# EAGLE design ptt_interface (EAGLE 7.7.0)
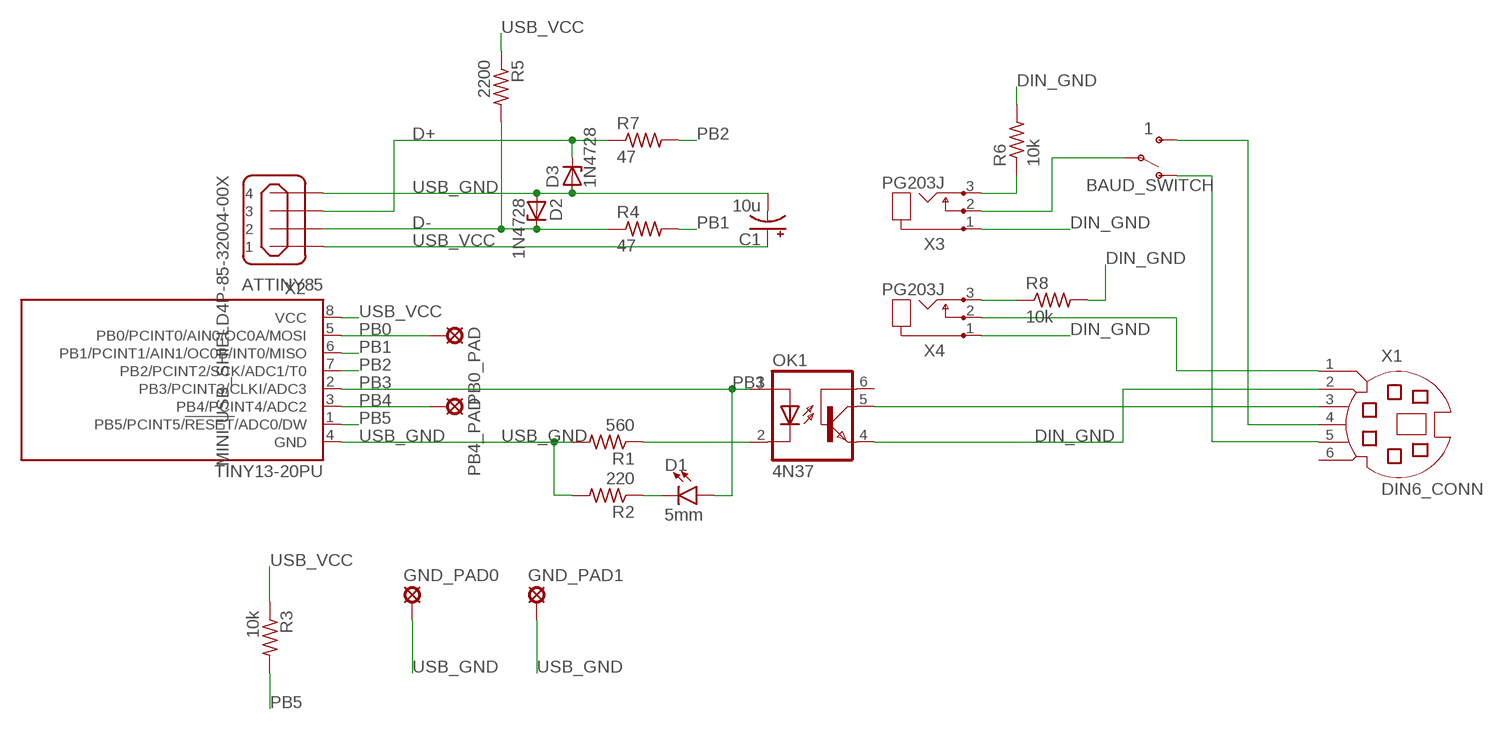
[diagram p0: schematic, sheet 1]

## Parts
ATTINY85  TINY13-20PU  [DIL08]
BAUD_SWITCH  1  SWITCH-SPDT  [SWITCH_SPDT_PTH_15X5.6MM]
C1  10u  CPOL-USE2.5-5  [E2,5-5]
D1  5mm  LED5MM  [LED_5MM]
D2  1N4728  [DO41Z10]
D3  1N4728  [DO41Z10]
GND_PAD0  LSP11  [LSP11]
GND_PAD1  LSP11  [LSP11]
OK1  4N37  [DIL06]
PB0_PAD  LSP11  [LSP11]
PB4_PAD  LSP11  [LSP11]
R1  560  R-US_0207/10  [0207/10]
R2  220  R-US_0207/10  [0207/10]
R3  10k  R-US_0207/10  [0207/10]
R4  47  R-US_0207/10  [0207/10]
R5  2200  R-US_0207/10  [0207/10]
R6  10k  R-US_0207/10  [0207/10]
R7  47  R-US_0207/10  [0207/10]
R8  10k  R-US_0207/10  [0207/10]
X1  DIN6_CONN  MD06SS  [MDIN06SS]
X2  MINI-USB_SHIELD4P-85-32004-00X  [85-32004-00X]
X3  PG203J  [PG203J]
X4  PG203J  [PG203J]

## Nets
D+: D3.C R7.1 X2.3
D-: D2.C R4.1 R5.2 X2.2
DIN_GND: OK1.4(EMI) R6.2 R8.2 X1.2 X3.1 X4.1
N$1: OK1.2(C) R1.1
N$2: D1.K(C) R2.1
N$3: OK1.5(COL) X1.3
N$4: BAUD_SWITCH.2(P) X3.2
N$5: R6.1 X3.3
N$6: R8.1 X4.3
N$7: BAUD_SWITCH.3(S) X1.4
N$8: BAUD_SWITCH.1(O) X1.5
N$10: X1.1 X4.2
PB0: ATTINY85.5(PB0/PCINT0/AIN0/OC0A/MOSI) PB0_PAD.MP
PB1: ATTINY85.6(PB1/PCINT1/AIN1/OC0B/INT0/MISO) R4.2
PB2: ATTINY85.7(PB2/PCINT2/SCK/ADC1/T0) R7.2
PB3: ATTINY85.2(PB3/PCINT3/CLKI/ADC3) D1.A OK1.1(A)
PB4: ATTINY85.3(PB4/PCINT4/ADC2) PB4_PAD.MP
PB5: ATTINY85.1(PB5/PCINT5/!RESET!/ADC0/DW) R3.2
USB_GND: ATTINY85.4(GND) C1.- D2.A D3.A GND_PAD0.MP GND_PAD1.MP R1.2 R2.2 X2.4
USB_VCC: ATTINY85.8(VCC) C1.+ R3.1 R5.1 X2.1
Unconnected: OK1.6(BAS) X1.6 X2.M1(S1) X2.M2(S2)

## Library data of the parts
ATTINY85 = atmel:TINY13: 8-bit AVR Microcontroller with 1K Bytes In-System Programmable Flash Source: http://www.atmel.com/dyn/resources/prod_documents/2535S.pdf; MPN: ATTINY13-20PU; OC_FARNELL: 9171550; OC_NEWARK: 96K6521
BAUD_SWITCH = dylon_mutz:SWITCH-SPDT: Single Pole, Double Throw (SPDT) Switch Single-pole, double-throw (SPDT) switch. Variant Overview SMD-AYZ0202 Surface Mount DPDT Switch <https://www.sparkfun.com/products/597> (COM-00597) Used on e.g. LilyPad Arduino USB - ATmega32U4 Board <https://www.sparkfun.com/products/12049> PTH-11.6X4.0MM SPDT Mini Power Switch <https://www.sparkfun.com/products/102> (COM-00102) Used on e.g. SparkFun Simon Says - Through-Hole Soldering Kit <https://www.sparkfun.com/products/10547> (KIT-10547) PTH-11.6X4.0MM-KIT KIT version of SPDT Mini Power Switch - Simplifies soldering by removing tStop of switch pins - only one side can be soldered. PTH-11.6X4.0MM-LOCK LOCK version of SPDT Mini Power Switch - Offset pins hold switch in place for easier soldering. SMD-RIGHT-ANGLE Surface Mount Right Angle Switch <https://www.sparkfun.com/products/10860> (COM-10860) Used on e.g. SparkFun ESP8266 Thing <https://www.sparkfun.com/products/13231>
C1 = rcl:CPOL-US: POLARIZED CAPACITOR, American symbol
D1 = SparkFun-LED:LED: LED (Generic) Standard schematic elements and footprints for 5mm, 3mm, 1206, and 0603 sized LEDs. Generic LEDs with no color specified.
D2 D3 = diode:1N4728: Z DIODE 3.3 V, 1W, 5 percent
GND_PAD0 GND_PAD1 PB0_PAD PB4_PAD = solpad:LSP11: SOLDER PAD drill 1.1 mm
OK1 = optocoupler:4N37: OPTO COUPLER Source: http://www.fairchildsemi.com/pf/4N/4N35-M.html; MF: FAIRCHILD SEMICONDUCTOR; MPN: 4N37; OC_FARNELL: 1612456; OC_NEWARK: 72K9948
R1-R8 = resistor:R-US_: RESISTOR, American symbol
X1 = dylon_mutz:MD06SS: YAMAICHI CONNECTOR; OC_FARNELL: unknown; OC_NEWARK: unknown
X2 = con-cypressindustries:MINI-USB_SHIELD4P-: MINI USB 4 Pol. Source: www.cypressindustries.com; OC_FARNELL: unknown; OC_NEWARK: unknown
X3 X4 = dylon_mutz:PG203J: MIC/HEADPHONE JACK CUI 3.5mm mono microphone/headphone jack MJ-3565N (CUI); OC_FARNELL: unknown; OC_NEWARK: unknown

## Board
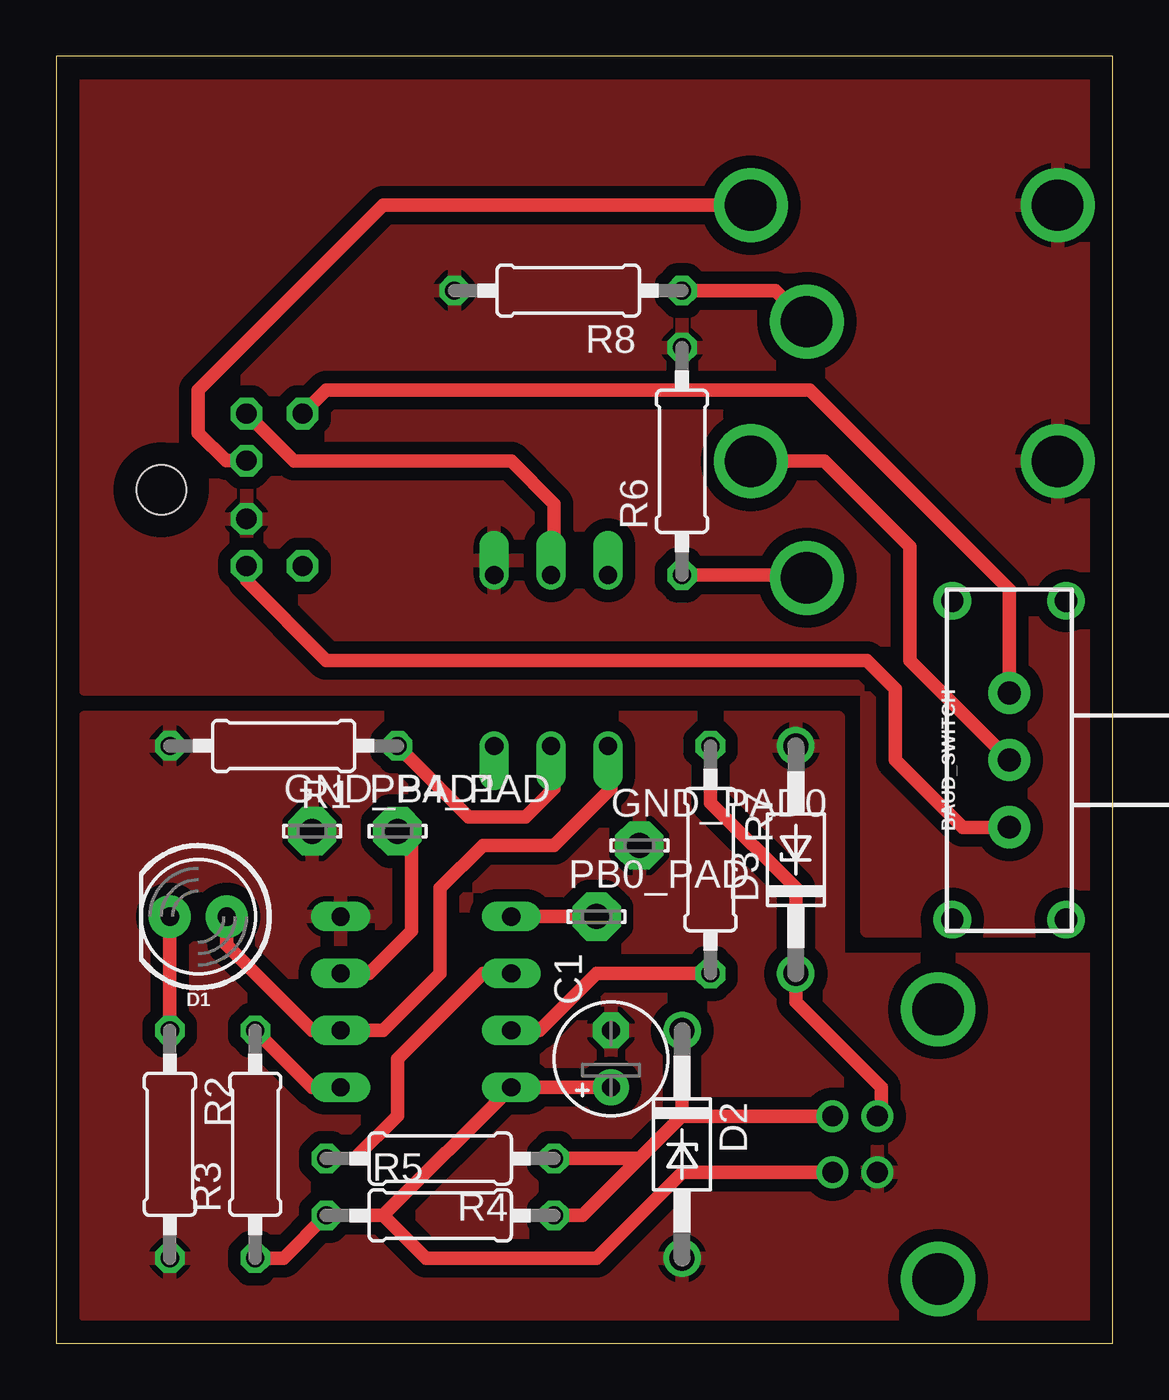
[diagram p1: board, top side]
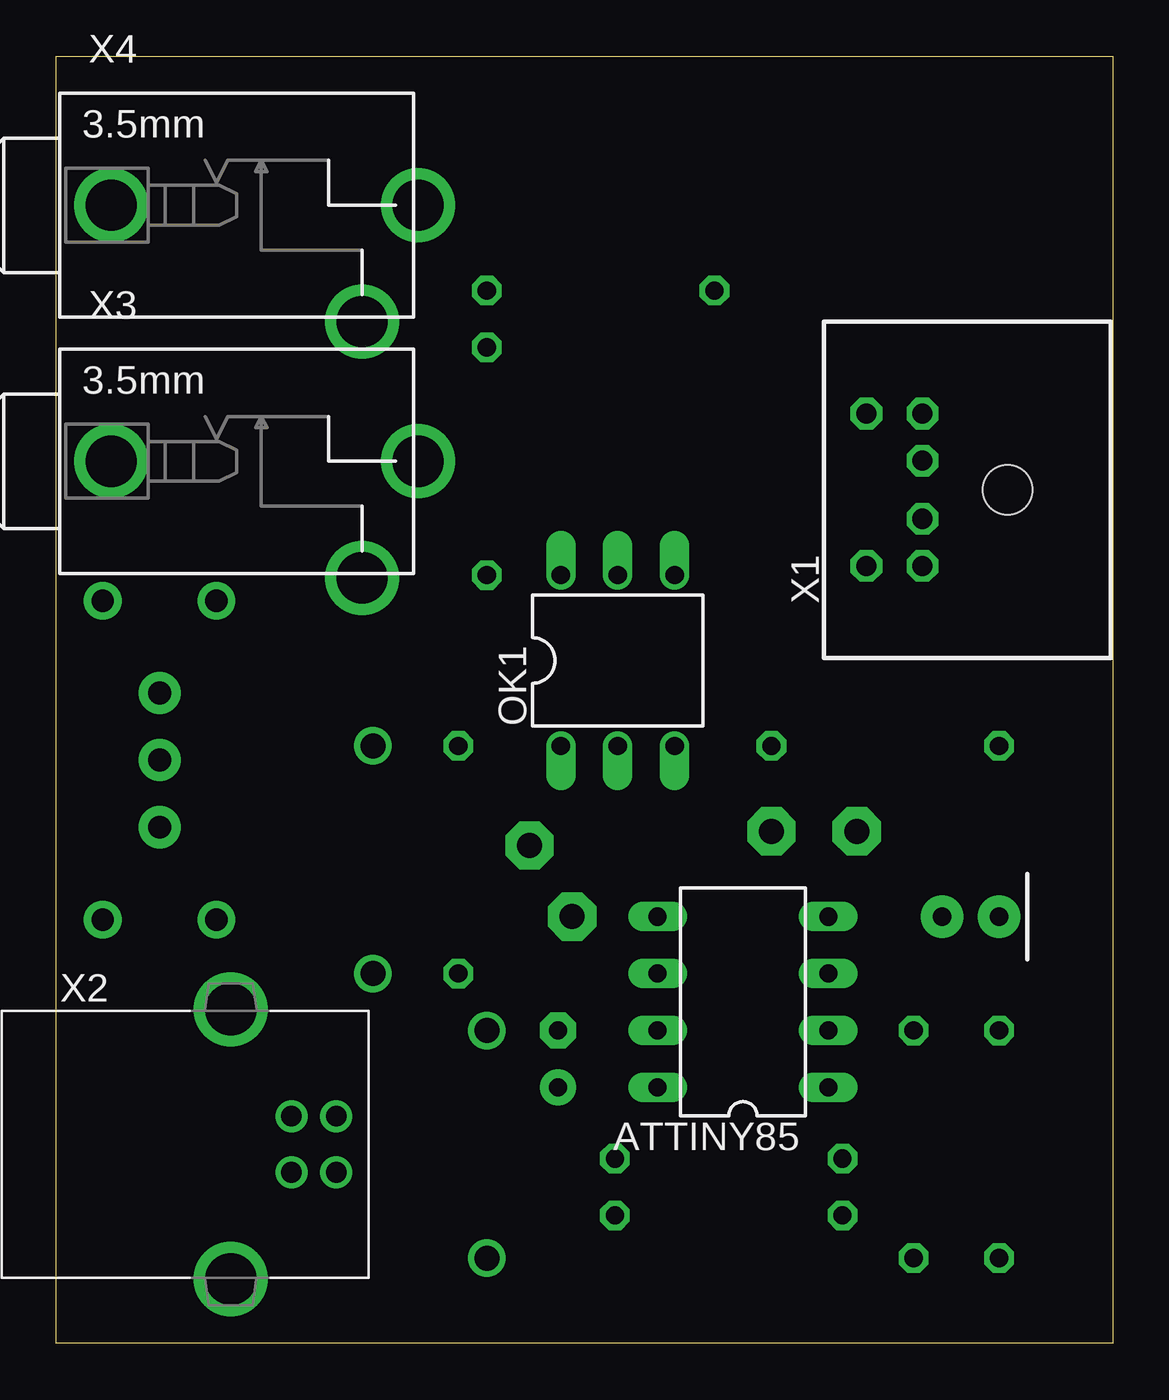
[diagram p2: board, bottom side, seen from below]

Size 47.17 x 57.46 mm. Coordinates in mm from the lower left corner, seen from the top.
Outline: 0,0 47.17,0 47.17,57.46 0,57.46 0,0
Copper layers (1*16): Top 0.035mm / dielectric 1.5mm / Bottom 0.035mm
Design rules "default *": minimum track width 10mil, minimum drill 24mil, track to track 22mil, track to pad 8mil, pad to pad 8mil, via to via 8mil, smd to smd 8mil, copper to edge 40mil, drill to drill 8mil, minimum pad ring 10mil, minimum via ring 8mil, stop-mask expansion 4mil, vias tented up to drill 0mil, thermal gap 10mil

### Footprints (pad centres in the part's own frame; a part is rotated, then mirrored left to right if it is on the bottom)
DIL08 = drill 0.813 long: 1 -3.81,-3.81; 2 -1.27,-3.81; 3 1.27,-3.81; 4 3.81,-3.81; 5 3.81,3.81; 6 1.27,3.81; 7 -1.27,3.81; 8 -3.81,3.81
SWITCH_SPDT_PTH_15X5.6MM = drill 1.016 pad 1.88: 1 0,2.997; 2 0,0; 3 0,-2.997 | drill 1 pad 1.676: P$1 -2.54,7.112; P$2 2.54,7.112; P$3 -2.54,-7.112; P$4 2.54,-7.112
E2,5-5 = drill 0.813 pad 1.6: + -1.27,0 | drill 0.813 pad 1.6 octagon: - 1.27,0
LED_5MM = drill 0.813 pad 1.88: A -1.27,0; K 1.27,0
DO41Z10 = drill 1.118: A 5.08,0; C -5.08,0
LSP11 = drill 1.118 pad 2.159 octagon: MP 0,0
DIL06 = drill 0.813 offset: 1 -2.54,-3.81; 2 0,-3.81; 3 2.54,-3.81; 4 2.54,3.81; 5 0,3.81; 6 -2.54,3.81
0207/10 = drill 0.813 octagon: 1 -5.08,0; 2 5.08,0
MDIN06SS = drill 0.9 octagon: 1 1.3,8.5; 2 -1.3,8.5; 3 3.4,8.5; 4 -3.4,8.5; 5 3.4,11; 6 -3.4,11 | hole 2.2: 0,4.7
85-32004-00X = drill 0.92 pad 1.27: 1 4.71,-1.25; 2 4.71,1.25; 3 2.71,1.25; 4 2.71,-1.25 | drill 2.3 pad 3: M1 0,6.02; M2 0,-6.02
PG203J = drill 2.286 pad 3.048: 1 -4.7,0; 2 9,0; 3 6.5,-5.2

### Placement (x,y rotation side)
ATTINY85  16.51,15.24 90 bottom
BAUD_SWITCH  42.55,26.04 0 top
C1  24.77,12.7 90 top
D1  6.35,19.05 180 top
D2  27.94,8.89 270 top
D3  33.02,21.59 90 top
GND_PAD0  26.04,22.23 0 top
GND_PAD1  11.43,22.86 0 top
OK1  22.1,30.48 0 bottom
PB0_PAD  24.13,19.05 0 top
PB4_PAD  15.24,22.86 0 top
R1  10.16,26.67 180 top
R2  5.08,8.89 270 top
R3  8.89,8.89 90 top
R4  17.14,8.26 180 top
R5  17.14,5.71 0 top
R6  27.94,39.37 90 top
R7  29.21,21.59 270 top
R8  22.86,46.99 180 top
X1  0,38.1 90 bottom
X2  39.37,8.89 0 bottom
X3  40.01,39.37 0 bottom
X4  40.01,50.8 0 bottom

### Tracks (layer width: path | path; a pad name or v marks a point on that pad's centre or on a via)
D+
  Top 0.61: R7.1 29.21,24.13 33.02,20.32 D3.C 33.02,15.24 36.83,11.43 36.83,10.31 X2.3
D-
  Top 0.61: R4.1 26.04,8.26 | 26.04,8.26 27.94,10.16 | 27.94,10.16 D2.C | X2.2 27.96,10.14 27.94,10.16 | R5.2 23.5,5.71 26.04,8.26
DIN_GND
  pour Top: 46.35,18.41 36.2,18.41 36.2,29.21 1.27,29.21 1.27,56.52 46.35,56.52
N$1
  Top 0.61: R1.1 18.41,23.5 20.95,23.5 22.23,24.77 22.23,26.54 OK1.2
N$2
  Top 0.61: R2.1 D1.K
N$3
  Top 0.61: X1.3 10.63,39.37 20.32,39.37 22.23,37.47 22.23,34.42 OK1.5
N$4
  Top 0.61: BAUD_SWITCH.2 38.1,30.48 38.1,35.56 34.29,39.37 X3.2
N$5
  Top 0.61: X3.3 33.38,34.29 R6.1
N$6
  Top 0.61: X4.3 32.12,46.99 R8.1
N$7
  Top 0.61: X1.4 8.5,34.05 12.06,30.48 36.2,30.48 37.47,29.21 37.47,26.04 40.46,23.04 BAUD_SWITCH.3
N$8
  Top 0.61: BAUD_SWITCH.1 42.55,33.66 33.66,42.55 12.04,42.55 X1.5
N$10
  Top 0.61: X1.1 7.59,39.4 6.35,40.64 6.35,42.55 14.61,50.8 X4.2
PB0
  Top 0.61: ATTINY85.5 PB0_PAD.MP
PB1
  Top 0.61: ATTINY85.6 19.05,16.51 15.24,12.7 15.24,10.16 13.34,8.26 R4.2
PB2
  Top 0.61: ATTINY85.7 21.59,13.97 24.13,16.51 R7.2
PB3
  Top 0.61: D1.A 7.62,17.78 11.43,13.97 ATTINY85.2 14.61,13.97 17.14,16.51 17.14,20.32 19.05,22.23 22.23,22.23 24.77,24.77 24.77,26.54 OK1.1
PB4
  Top 0.61: ATTINY85.3 13.97,16.51 15.88,18.41 15.88,22.23 PB4_PAD.MP
PB5
  Top 0.61: R3.2 11.43,11.43 ATTINY85.1
USB_GND
  pour Top: 1.27,1.27 46.35,1.27 46.35,17.14 34.92,17.14 34.92,27.94 1.27,27.94
USB_VCC
  Top 0.61: R3.1 10.16,3.81 R5.1 14.61,5.71 | 14.61,5.71 ATTINY85.8 C1.+ | X2.1 27.96,7.64 24.13,3.81 16.51,3.81 14.61,5.71